# Altium project Car.PrjPcb
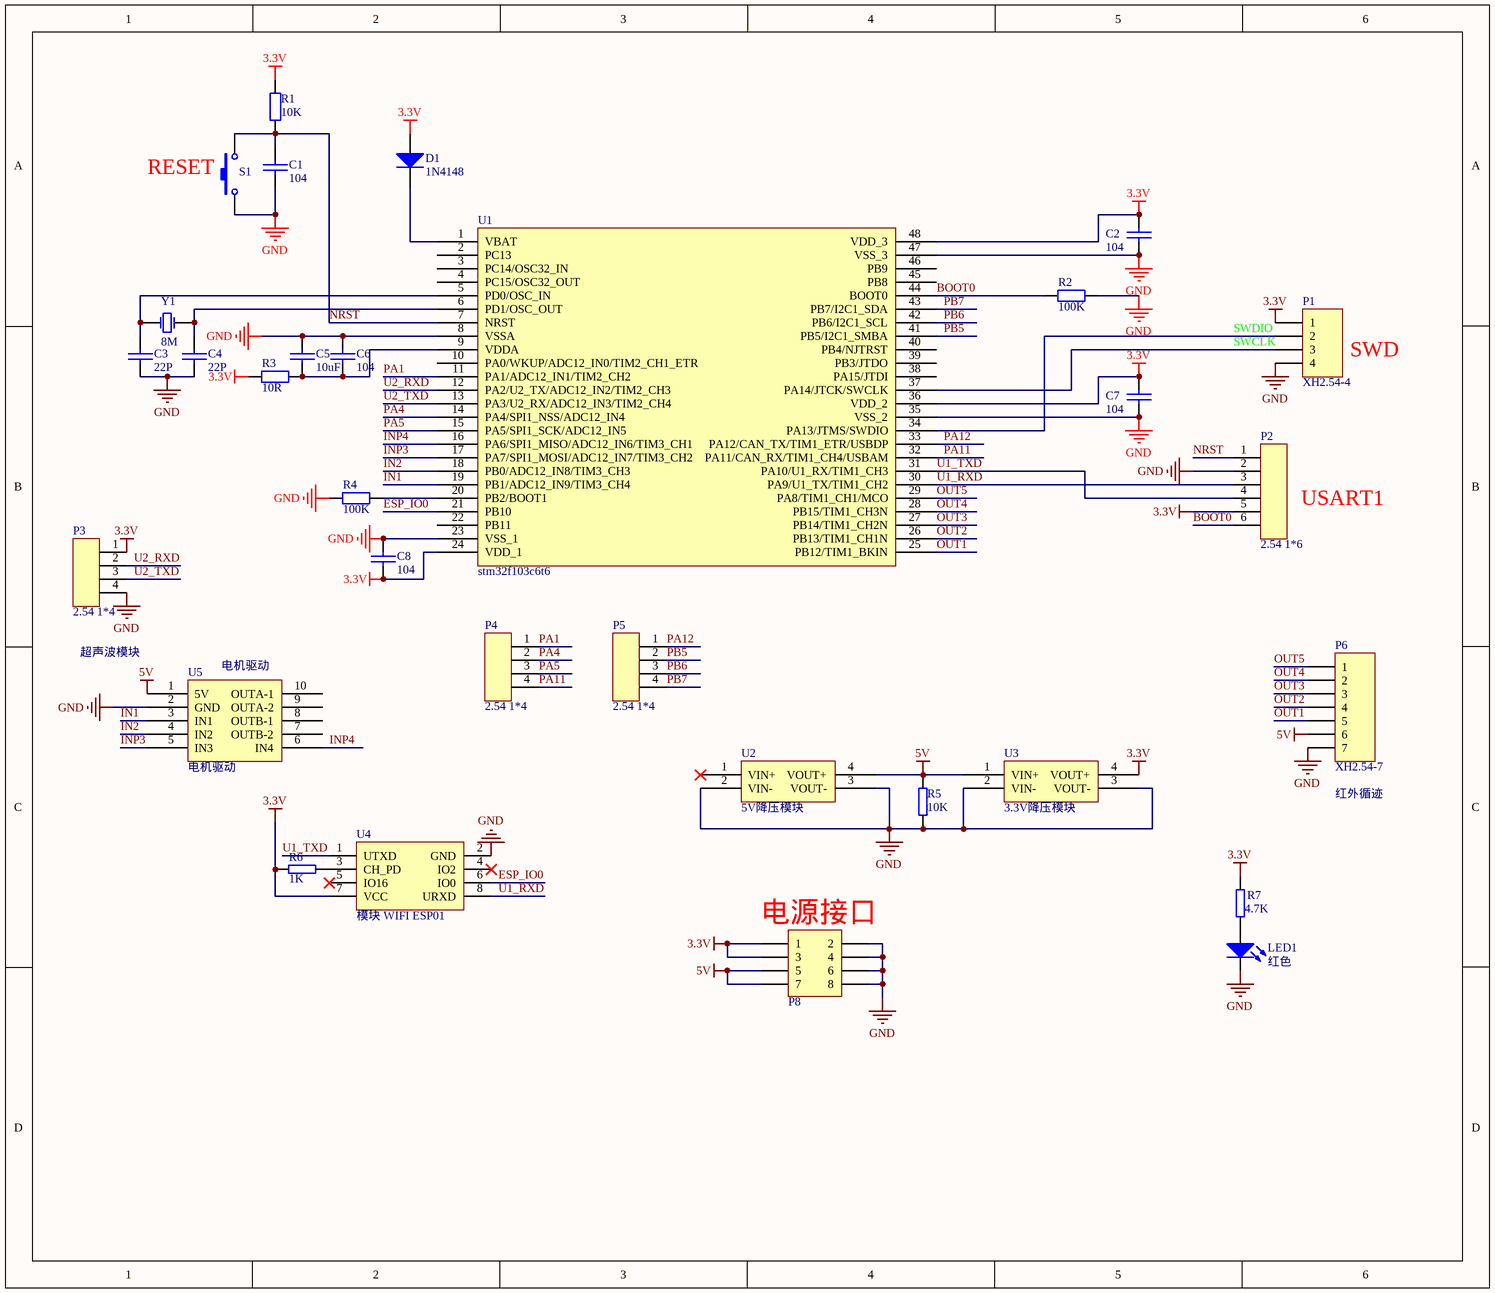
[diagram p0: car.SchDoc]
1 sheet, 31 parts. Net scope: global (net labels, ports and power ports of the same name join across sheets).

## Sheet car.SchDoc
size 279 x 241 mm; SheetNumber: 1; SheetTotal: 1

### Parts
C1  104  [0805]
C2  104  [0805]
C3  22P  [0805]
C4  22P  [0805]
C5  10uF  [1206]
C6  104  [0805]
C7  104  [0805]
C8  104  [0805]
D1  1N4148  [二极管 贴片 IN4148]
LED1  红色  [LED0805]
P1  XH2.54-4  [VH2.54_4]
P2  2.54 1*6  [单排插针 2.54 1*6]
P3  2.54 1*4  [单排插针 2.54 1*4]
P4  2.54 1*4  [单排插针 2.54 1*4]
P5  2.54 1*4  [单排插针 2.54 1*4]
P6  XH2.54-7  [VH2.54_7]
P8  双排插针 2.54 2*4  [双排插针 2.54 2*4]  (value not drawn)
R1  10K  [0805]
R2  100K  [0805]
R3  10R  [0805]
R4  100K  [0805]
R5  10K  [0805]
R6  1K  [0805]
R7  4.7K  [0805]
S1  key  [按键 轻触  6*3]  (value not drawn)
U1  stm32f103c6t6  [STM32F103C6T6]
U2  5V降压模块  [降压模块]
U3  3.3V降压模块  [降压模块]
U4  模块 WIFI ESP01  [模块 WIFI ESP01]
U5  电机驱动  [电机驱动]
Y1  8M  [晶振 BCY-W2/E4.7]

### Nets
3.3V: C2.1 C7.1 C8.1 D1.1(A) P1.1 P2.5 P3.1 P8.1 P8.3 R1.1 R3.1 R6.2 R7.2 U1.24(VDD_1) U1.36(VDD_2) U1.48(VDD_3) U3.4(VOUT+) U4.7(VCC)
5V: P6.6 P8.5 P8.7 R5.2 U2.4(VOUT+) U3.1(VIN+) U5.1(5V)
GND: C1.1 C2.2 C3.1 C4.1 C5.2 C6.2 C7.2 C8.2 LED1.2(K) P1.4 P2.2 P3.4 P6.7 P8.2 P8.4 P8.6 P8.8 R2.1 R4.1 R5.1 S1.1 U1.8(VSSA) U1.23(VSS_1) U1.35(VSS_2) U1.47(VSS_3) U2.2(VIN-) U2.3(VOUT-) U3.2(VIN-) U3.3(VOUT-) U4.2(GND) U5.2(GND)
BOOT0: P2.6 R2.2 U1.44(BOOT0)
ESP_IO0: U1.21(PB10) U4.6(IO0)
IN1: U1.19(PB1/ADC12_IN9/TIM3_CH4) U5.3(IN1)
IN2: U1.18(PB0/ADC12_IN8/TIM3_CH3) U5.4(IN2)
INP3: U1.17(PA7/SPI1_MOSI/ADC12_IN7/TIM3_CH2) U5.5(IN3)
INP4: U1.16(PA6/SPI1_MISO/ADC12_IN6/TIM3_CH1) U5.6(IN4)
NRST: C1.2 P2.1 R1.2 S1.2 U1.7(NRST)
OUT1: P6.5 U1.25(PB12/TIM1_BKIN)
OUT2: P6.4 U1.26(PB13/TIM1_CH1N)
OUT3: P6.3 U1.27(PB14/TIM1_CH2N)
OUT4: P6.2 U1.28(PB15/TIM1_CH3N)
OUT5: P6.1 U1.29(PA8/TIM1_CH1/MCO)
PA1: P4.1 U1.11(PA1/ADC12_IN1/TIM2_CH2)
PA4: P4.2 U1.14(PA4/SPI1_NSS/ADC12_IN4)
PA5: P4.3 U1.15(PA5/SPI1_SCK/ADC12_IN5)
PA11: P4.4 U1.32(PA11/CAN_RX/TIM1_CH4/USBAM)
PA12: P5.1 U1.33(PA12/CAN_TX/TIM1_ETR/USBDP)
PB5: P5.2 U1.41(PB5/I2C1_SMBA)
PB6: P5.3 U1.42(PB6/I2C1_SCL)
PB7: P5.4 U1.43(PB7/I2C1_SDA)
SWCLK: P1.3 U1.37(PA14/JTCK/SWCLK)
SWDIO: P1.2 U1.34(PA13/JTMS/SWDIO)
U1_RXD: P2.3 U1.30(PA9/U1_TX/TIM1_CH2) U4.8(URXD)
U1_TXD: P2.4 U1.31(PA10/U1_RX/TIM1_CH3) U4.1(UTXD)
U2_RXD: P3.2 U1.12(PA2/U2_TX/ADC12_IN2/TIM2_CH3)
U2_TXD: P3.3 U1.13(PA3/U2_RX/ADC12_IN3/TIM2_CH4)
NetC3_2: C3.2 U1.5(PD0/OSC_IN) Y1.2(OSC2)
NetC4_2: C4.2 U1.6(PD1/OSC_OUT) Y1.1(OSC1)
NetC5_1: C5.1 C6.1 R3.2 U1.9(VDDA)
NetD1_2: D1.2(K) U1.1(VBAT)
NetLED1_1: LED1.1(A) R7.1
NetR4_2: R4.2 U1.20(PB2/BOOT1)
NetR6_1: R6.1 U4.3(CH_PD)

Not connected (* = marked no-connect by the designer): U1 2(PC13) 3(PC14/OSC32_IN) 4(PC15/OSC32_OUT) 10(PA0/WKUP/ADC12_IN0/TIM2_CH1_ETR) 22(PB11) 38(PA15/JTDI) 39(PB3/JTDO) 40(PB4/NJTRST) 45(PB8) 46(PB9); U2 1(VIN+)*; U4 4(IO2)* 5(IO16)*; U5 7(OUTB-2) 8(OUTB-1) 9(OUTA-2) 10(OUTA-1)

### Notes on the sheet
- (near S1) RESET
- (near P1) SWD
- (near P2) USART1
- 超声波模块
- (near U5) 电机驱动
- (near P6) 红外循迹
- (near P8) 电源接口

### Library data of the parts
C1-C8 = 贴片电容 0805: 名称: 贴片电容; 封装: 0603; 单位: 个
D1 = 二极管 贴片 1N4148: 名称: 贴片二极管; 封装: 1206; 单位: 个
LED1 = 二极管 贴片发光 0805: 名称: 贴片发光二极管; 封装: 0805; 单位: 个
P1 = 联结件 XH2.54-4: 名称: 联结件; 单位: 套; 封装: XH2.54-4
P2 = 联结件 单排插针 2.54 1*6: 单位: 片; 封装: DIP; 名称: 单排插针
P3-P5 = 联结件 单排插针 2.54 1*4: 单位: 片; 封装: DIP; 名称: 单排插针
P6 = 联结件 XH2.54-7: 名称: 联结件; 单位: 套; 封装: XH2.54-7
P8 = 联结件 双排插针 2.54 2*4: 名称: 联结件; 单位: 个; 封装: 直插
R1 R3 = 贴片电阻 0603: 名称: 贴片电阻; 封装: 0603; 单位: 个
R2 R4 = 贴片电阻 0805: 名称: 贴片电阻; 单位: 个; 封装: 0805
R5-R7 = 电阻 贴片 0805: 名称: 贴片电阻; 单位: 个; 封装: 0805
S1 = 按键 轻触 3*6: 单位: 个; 名称: 开关; 封装: 直插 12*12*12
U2 U3 = 降压模块
U4 = 模块 WIFI ESP01: 单位: 个; 封装: 直插; 名称: WIFI模块
Y1 = 晶振 直插矮: 名称: 晶振; 封装: 直插矮; 单位: 个